# EasyEDA Pro project OMO - WayBox.eprj, schematic Schematic2
Board Name: Board2; Create Date: 2025-07-23; Page Name: P1; Project Name: OMO - WayBox; Schematic Name: Schematic2; Update Date: 2025-07-24; Company: EasyEDA.com; Page Size: A4; Version: V1.0
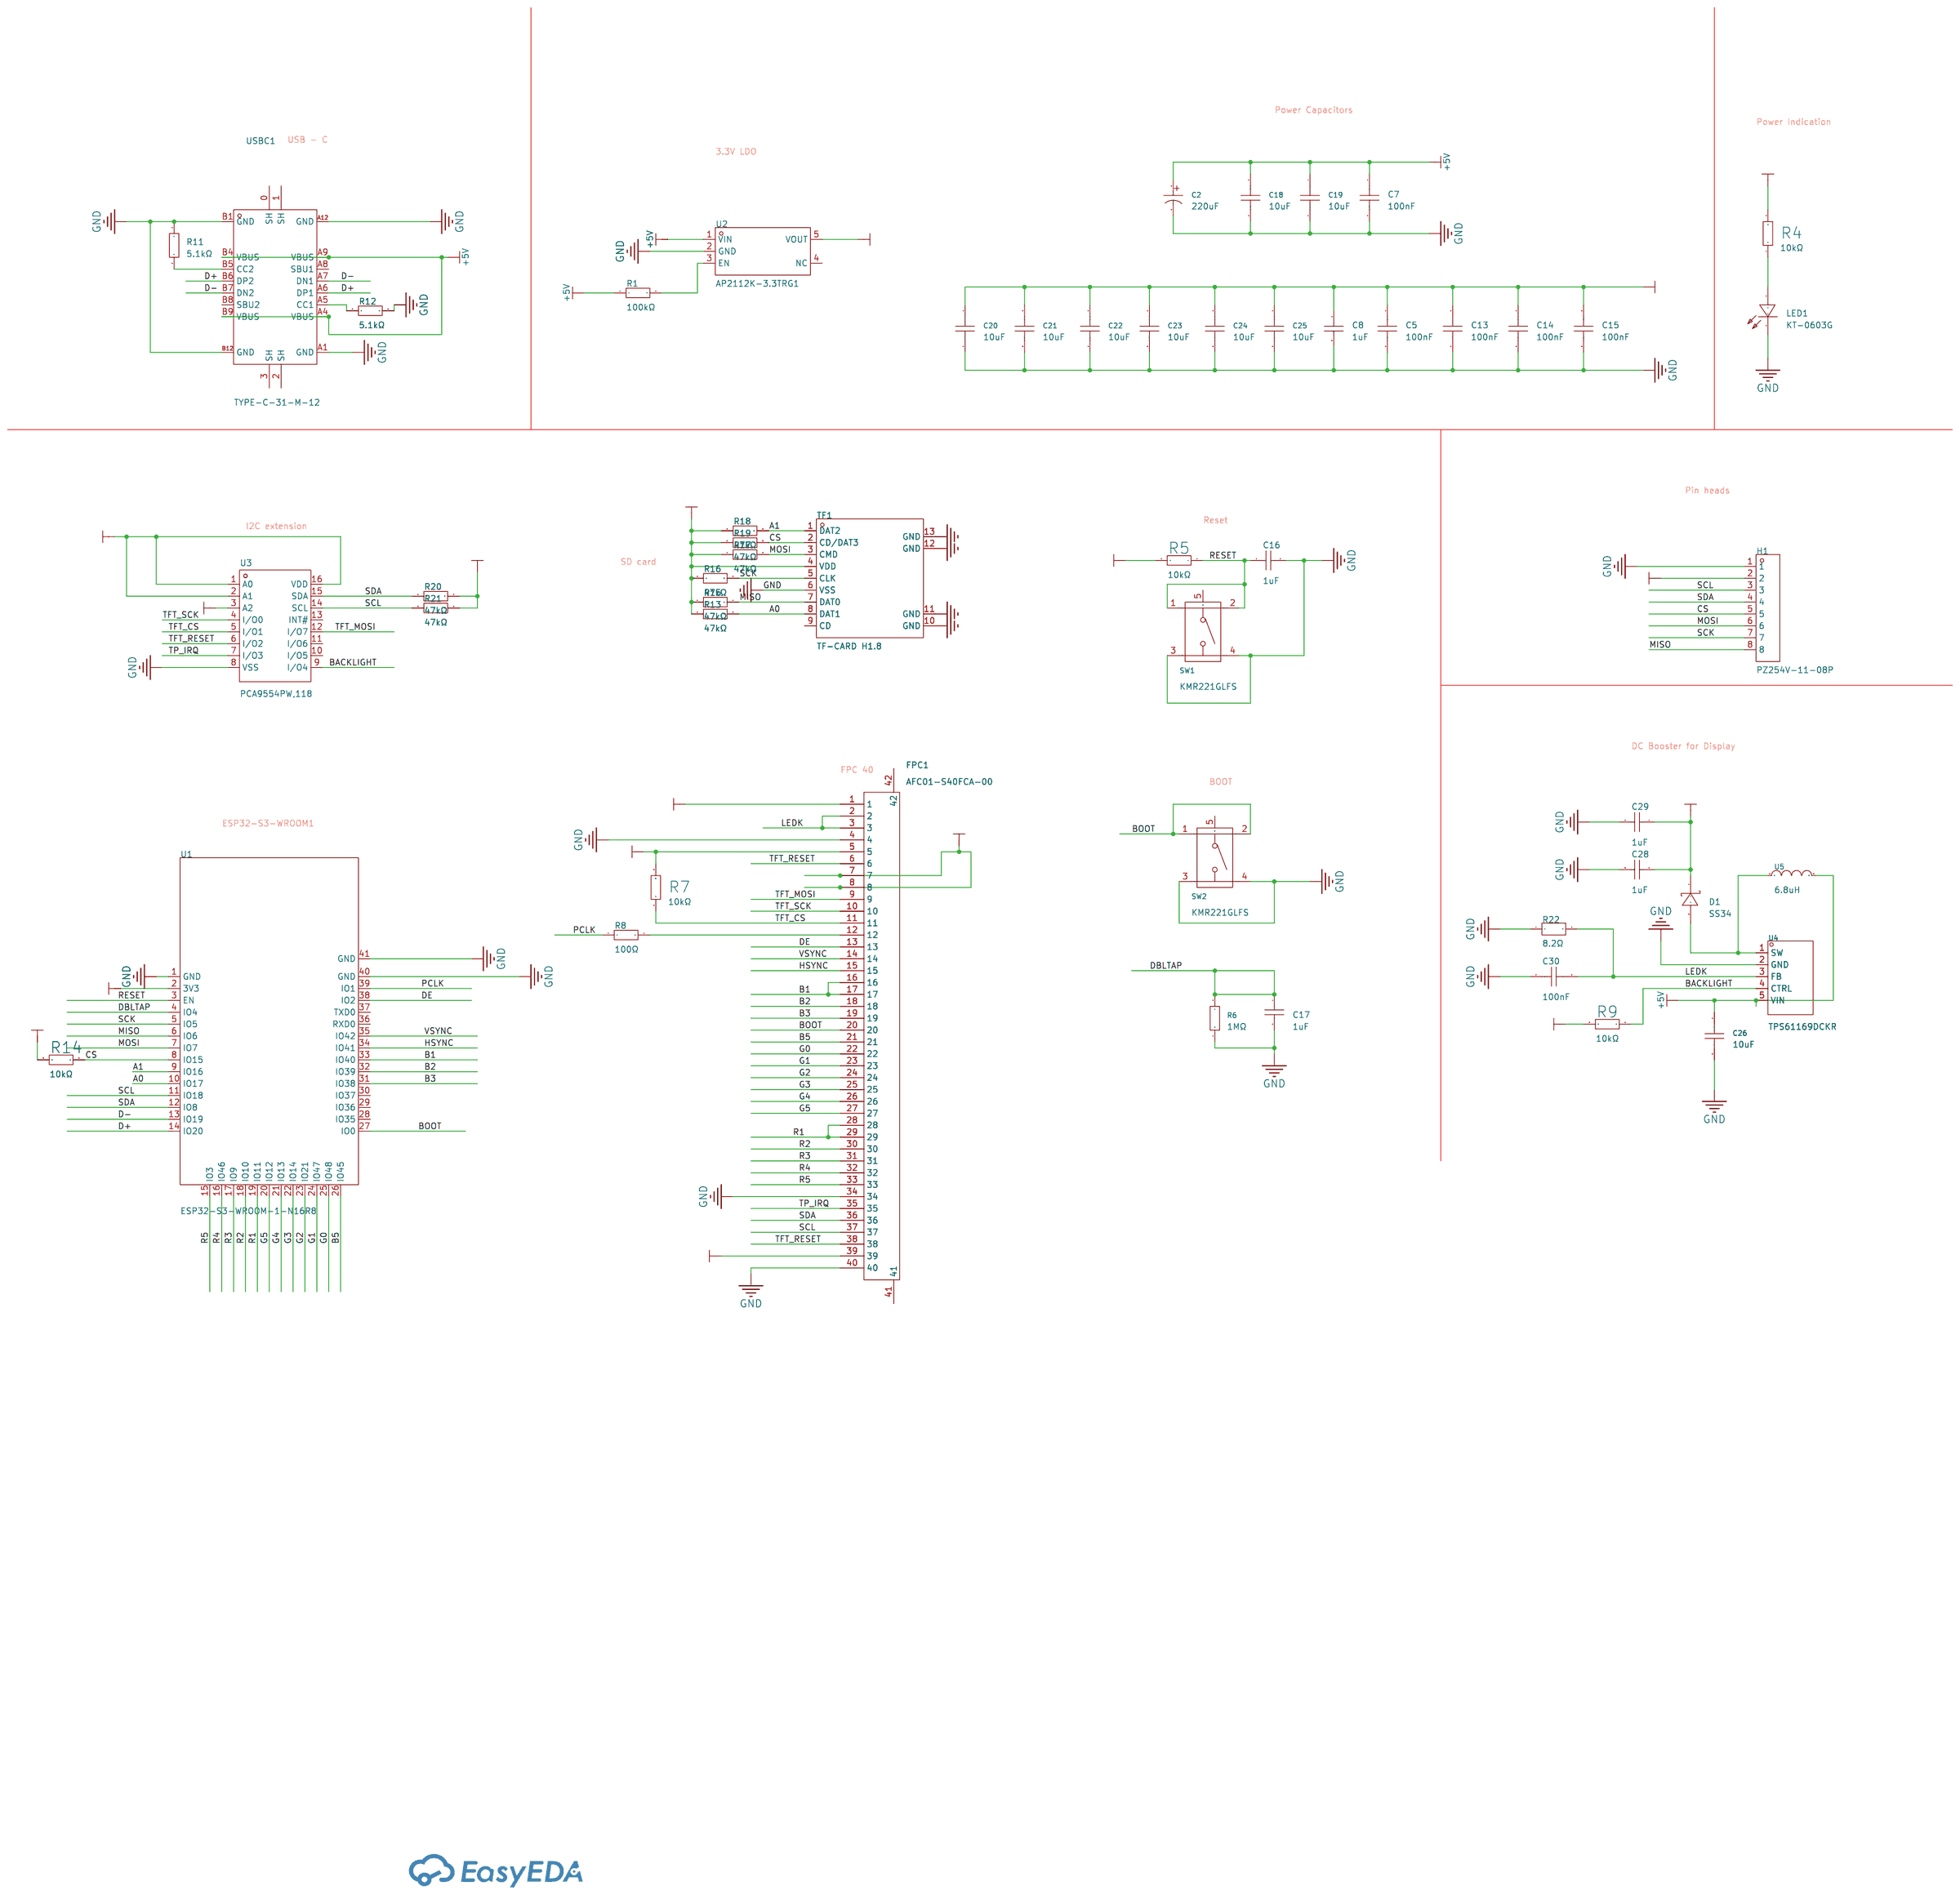
[diagram p1: schematic sheet]

## Parts
C2  220uF  [CAP-SMD_BD6.3-L6.6-W6.6-LS7.2-FD]
C5  100nF  [C0402]
C7  100nF  [C0402]
C8  1uF  [C0603]
C13  100nF  [C0402]
C14  100nF  [C0402]
C15  100nF  [C0402]
C16  1uF  [C0603]
C17  1uF  [C0603]
C18  10uF  [C0603]
C19  10uF  [C0603]
C20  10uF  [C0603]
C21  10uF  [C0603]
C22  10uF  [C0603]
C23  10uF  [C0603]
C24  10uF  [C0603]
C25  10uF  [C0603]
C26  10uF  [C0603]
C28  1uF  [C0603]
C29  1uF  [C0603]
C30  100nF  [C0402]
D1  SS34  [SMA_L4.3-W2.6-LS5.2-RD]
FPC1  AFC01-S40FCA-00  [FPC-SMD_P0.50-40P_FGS-XJ-H2.0]
H1  PZ254V-11-08P  [HDR-TH_8P-P2.54-V-M]
LED1  KT-0603G  [LED0603-RD]
R1  100kΩ  [R0603]
R4  10kΩ  [R0603]
R5  10kΩ  [R0603]
R6  1MΩ  [R0603]
R7  10kΩ  [R0603]
R8  100Ω  [R0402]
R9  10kΩ  [R0603]
R11  5.1kΩ  [R0603]
R12  5.1kΩ  [R0603]
R13  47kΩ  [R0402]
R14  10kΩ  [R0603]
R15  47kΩ  [R0402]
R16  47kΩ  [R0402]
R17  47kΩ  [R0402]
R18  47kΩ  [R0402]
R19  47kΩ  [R0402]
R20  47kΩ  [R0402]
R21  47kΩ  [R0402]
R22  8.2Ω  [R0402]
SW1  KMR221GLFS  [KEY-SMD_KMR2XXGXXX]
SW2  KMR221GLFS  [KEY-SMD_KMR2XXGXXX]
TF1  TF-CARD H1.8  [TF-SMD_TF-CARD-H1.8]
U1  ESP32-S3-WROOM-1-N16R8  [WIRELM-SMD_ESP32-S3-WROOM-1]
U2  AP2112K-3.3TRG1  [SOT-25-5_L2.9-W1.6-P0.95-LS2.8-BL]
U3  PCA9554PW,118  [TSSOP-16_L5.0-W4.4-P0.65-LS6.4-BL]
U4  TPS61169DCKR  [SC-70-5_L2.1-W1.3-P0.65-LS2.1-BR]
U5  6.8uH  [IND-SMD_L4.5-W4.1_TMPC0412HP]
USBC1  TYPE-C-31-M-12  [USB-C_SMD-TYPE-C-31-M-12]

## Library data of the parts
C2 = RVT0J221M0605: LCSC Part Name: 220uF ±20% 6.3V; Supplier Part: C32514; Manufacturer: HONOR(荣誉); Supplier Footprint: SMD,D6.3xL5.4mm; JLCPCB Part Class: Extended Part; Datasheet: https://atta.szlcsc.com/upload/public/pdf/source/20210521/C113284_25C86AE95FB541053FE695F13EA8E7D0.pdf; Supplier: LCSC; Tolerance: ±20%; Lifetime @ Temp: 2000hrs@105℃; Operating Temperature: -55℃~+105℃
C5 C7 C13-C15 C30 = CL05B104KO5NNNC: LCSC Part Name: 100nF ±10% 16V; Supplier Part: C1525; Manufacturer: SAMSUNG(三星); Supplier Footprint: 0402; JLCPCB Part Class: Basic Part; Datasheet: https://atta.szlcsc.com/upload/public/pdf/source/20160218/1457707763339.pdf; Supplier: LCSC; Tolerance: ±10%
C8 C16 C17 C28 C29 = CL10A105KO8NNNC: LCSC Part Name: 1uF ±10% 16V; Supplier Part: C1592; Manufacturer: SAMSUNG(三星); Supplier Footprint: 0603; JLCPCB Part Class: Extended Part; Datasheet: https://atta.szlcsc.com/upload/public/pdf/source/20220919/9FBE606BE0D9532D730F292EB26DC5BB.pdf; Supplier: LCSC; Tolerance: ±10%
C18-C26 = GRM188R61E106KA73D: LCSC Part Name: 10uF ±10% 25V; Supplier Part: C344022; Manufacturer: muRata(村田); Supplier Footprint: 0603; JLCPCB Part Class: Extended Part; Datasheet: https://atta.szlcsc.com/upload/public/pdf/source/20181211/C344022_BB98D43E7DA95E5A749FBFE073C8A3E0.pdf; Supplier: LCSC; Tolerance: ±10%
D1 = SS34_C8678: LCSC Part Name: 电压:40V 电流:3A; Supplier Part: C8678; Manufacturer: MDD(辰达半导体); Supplier Footprint: SMA(DO-214AC); JLCPCB Part Class: Basic Part; Datasheet: https://atta.szlcsc.com/upload/public/pdf/source/20240710/2118BB86FDDB2E0B294389AC1F3F65C8.pdf; Supplier: LCSC; Diode Configuration: Independent Type; Forward Voltage (Vf@If): 550mV@3A; Reverse Voltage (Vr): 40V; Rectified Current: 3A; Reverse Leakage Current (Ir): 500uA@40V
FPC1 = AFC01-S40FCA-00: LCSC Part Name: 间距:0.5mm P数:40P 翻盖式 下接; Supplier Part: C262674; Manufacturer: JS(钜硕电子); Supplier Footprint: SMD,P=0.5mm,卧贴; JLCPCB Part Class: 扩展库; Datasheet: https://atta.szlcsc.com/upload/public/pdf/source/20190816/C413942_2A72D1AC756EAE17EEDF756A339D4500.pdf; Supplier: LCSC; Locking Feature: 翻盖式; Contact Type: 下接; Number of Contacts: 40P; Pitch: 0.5mm; Mounting Type: 卧贴; FFC, FCB Thickness: 0.3mm; Height Above Board: 2mm
H1 = PZ254V-11-08P: LCSC Part Name: 间距:2.54mm 1x8P 直插 方针; Supplier Part: C492407; Manufacturer: XFCN(兴飞); Supplier Footprint: 插件,P=2.54mm; JLCPCB Part Class: 扩展库; Datasheet: https://atta.szlcsc.com/upload/public/pdf/source/20200309/C492407_83A6FB26A2233368EDB9516968EC6149.pdf; Supplier: LCSC; Pin Structure: 1x8P; Pitch: 2.54mm; Circluar Pins/Square Pins: 方针; Mounting Type: 直插; Number of Rows: 单排; Number of Pins: 8P; Length of Mating Pin: 6mm; Insulation Height: 2.5mm; Length of End Connection Pin: 3mm; Contact Material: 黄铜; Operating Temperature Range: -40℃~+105℃; Color: 黑色
LED1 = KT-0603G: LCSC Part Name: 0603 翠绿 高亮; Supplier Part: C12624; Manufacturer: KENTO; Supplier Footprint: 0603; JLCPCB Part Class: Extended Part; Datasheet: https://atta.szlcsc.com/upload/public/pdf/source/20160120/1457707754255.pdf; Supplier: LCSC; Emitted Color: Emerald
R1 = 0603WAF1003T5E: LCSC Part Name: 100kΩ ±1% 100mW 厚膜电阻; Supplier Part: C25803; Manufacturer: UNI-ROYAL(厚声); Supplier Footprint: 0603; Datasheet: https://atta.szlcsc.com/upload/public/pdf/source/20200306/C422600_1E6D84923E4A46A82E41ADD87F860B5C.pdf; Supplier: LCSC; Type: Thick Film Resistors; Tolerance: ±1%; Temperature Coefficient: ±100ppm/℃; Operating Temperature Range: -55℃~+155℃
R4 R5 R7 R9 R14 = 0603WAF1002T5E: LCSC Part Name: 厚膜电阻 10kΩ ±1% 100mW; Supplier Part: C25804; Manufacturer: UNI-ROYAL(厚声); Supplier Footprint: 0603; Datasheet: https://atta.szlcsc.com/upload/public/pdf/source/20200306/C422600_1E6D84923E4A46A82E41ADD87F860B5C.pdf; Supplier: LCSC; Type: Thick Film Resistors; Tolerance: ±1%; Temperature Coefficient: ±100ppm/℃; Operating Temperature Range: -55℃~+155℃
R6 = 0603WAF1004T5E: LCSC Part Name: 1MΩ ±1% 100mW 厚膜电阻; Supplier Part: C22935; Manufacturer: UNI-ROYAL(厚声); Supplier Footprint: 0603; JLCPCB Part Class: Basic Part; Datasheet: https://atta.szlcsc.com/upload/public/pdf/source/20200306/C422600_1E6D84923E4A46A82E41ADD87F860B5C.pdf; Supplier: LCSC; Type: Thick Film Resistors; Tolerance: ±1%; Temperature Coefficient: ±100ppm/℃; Operating Temperature Range: -55℃~+155℃
R8 = AR02BTC1000: LCSC Part Name: 薄膜电阻 100Ω ±0.1% 62.5mW; Supplier Part: C317909; Manufacturer: Viking(光颉); Supplier Footprint: 0402; Datasheet: https://atta.szlcsc.com/upload/public/pdf/source/20191129/C465721_10D49275DB41E427863CE9C8D788770A.pdf; Supplier: LCSC; Type: Thin Film Resistor; Tolerance: ±0.1%; Temperature Coefficient: ±25ppm/℃; Operating Temperature Range: -55℃~+155℃
R11 R12 = 0603WAF5101T5E: LCSC Part Name: 5.1kΩ ±1% 100mW 厚膜电阻; Supplier Part: C23186; Manufacturer: UNI-ROYAL(厚声); Supplier Footprint: 0603; Datasheet: https://atta.szlcsc.com/upload/public/pdf/source/20200306/C422600_1E6D84923E4A46A82E41ADD87F860B5C.pdf; Supplier: LCSC; Type: Thick Film Resistors; Tolerance: ±1%; Temperature Coefficient: ±100ppm/℃; Operating Temperature Range: -55℃~+155℃
R13 R15-R21 = 0402WGF4702TCE: LCSC Part Name: 47kΩ ±1% 62.5mW 厚膜电阻; Supplier Part: C25792; Manufacturer: UNI-ROYAL(厚声); Supplier Footprint: 0402; JLCPCB Part Class: 基础库; Datasheet: https://atta.szlcsc.com/upload/public/pdf/source/20200306/C422600_1E6D84923E4A46A82E41ADD87F860B5C.pdf; Supplier: LCSC; Type: 厚膜电阻; Tolerance: ±1%; Power(Watts): 62.5mW; Overload Voltage (Max): 50V; Temperature Coefficient: ±100ppm/℃; Operating Temperature Range: -55℃~+155℃
R22 = FRC0402F8R20TS: LCSC Part Name: 8.2Ω ±1% 62.5mW 厚膜电阻; Supplier Part: C2998155; Manufacturer: FOJAN(富捷); Supplier Footprint: 0402; JLCPCB Part Class: 扩展库; Datasheet: https://atta.szlcsc.com/upload/public/pdf/source/20211221/925EC7D7225764EE0046F22065062C87.pdf; Supplier: LCSC; Type: 厚膜电阻; Tolerance: ±1%; Power(Watts): 62.5mW; Voltage-Supply(Max): 50V; Temperature Coefficient: ±200ppm/℃; Operating Temperature: -55℃~+155℃
SW1 SW2 = KMR221GLFS: LCSC Part Name: 4.6*2.8*1.9mm 立贴 轻触开关; Supplier Part: C72443; Manufacturer: C&K; Supplier Footprint: SMD; JLCPCB Part Class: Extended Part; Datasheet: https://atta.szlcsc.com/upload/public/pdf/source/20181012/C265019_000848423B8E84768868498C37CC451B.pdf; Supplier: LCSC; Circuit: SPST; Actuator Style: Round Button; Operating Force: 200gf; Mounting Style: Brick nogging; Switch Length: 4.6mm; Switch Width: 2.8mm; Switch Height: 1.9mm; Contact Current: 50mA; Voltage Rating (DC): 32V; Pin Style: Gull Wing; Operating Temperature: -40℃~+85℃
TF1 = TF-CARD H1.8: LCSC Part Name: 自弹式 MicroSD卡(TF卡) 卡座; Supplier Part: C7529389; Manufacturer: SHOU HAN(首韩); Supplier Footprint: SMD; JLCPCB Part Class: 扩展库; Datasheet: https://atta.szlcsc.com/upload/public/pdf/source/20230818/611DB5E7B45C91025B0B37F957961A64.pdf; Supplier: LCSC; Card Connection Mode: 自弹式; Card Type: MicroSD卡(TF卡); Connector Type: 卡座; Maximum Body Height: 1.8mm; Operating Temperature Range: -40℃~+70℃
U1 = ESP32-S3-WROOM-1-N16R8: LCSC Part Name: 通用型Wi-Fi+低功耗蓝牙MCU模组; Supplier Part: C2913202; Manufacturer: ESPRESSIF(乐鑫); Supplier Footprint: SMD,18x25.5mm; JLCPCB Part Class: Extended Part; Datasheet: https://atta.szlcsc.com/upload/public/pdf/source/20241030/6A412B13087E1327DF6279F5735253CA.pdf; Supplier: LCSC
U2 = AP2112K-3.3TRG1: LCSC Part Name: 输入6V 输出3.3V 600mA; Supplier Part: C51118; Manufacturer: DIODES(美台); Supplier Footprint: SOT-25-5; JLCPCB Part Class: Extended Part; Datasheet: https://atta.szlcsc.com/upload/public/pdf/source/20171221/C51118_15138312998391195590.pdf; Supplier: LCSC; Output Type: Fixed; Maximum Input Voltage: 6V; Output Voltage: 3.3V; Output Current: 600mA; Power Supply Rejection Ratio (PSRR): 65dB@(1kHz); Dropout Voltage: 400mV@(600mA); standby current: 80uA; Feature: ESD Protection；Automatic Discharge Function；Low ESR；Thermal Protection(TSD)；Overcurrent Protection(OCP)；With ability; Operating Temperature: -40℃~+85℃; Output Polarity: Positive electrode; Number of Outputs: 1
U3 = PCA9554PW,118: LCSC Part Name: 带复位的8位I2C总线和SMBus I/O端口; Supplier Part: C17230; Manufacturer: NXP(恩智浦); Supplier Footprint: TSSOP-16; JLCPCB Part Class: Extended Part; Datasheet: https://atta.szlcsc.com/upload/public/pdf/source/20130823/1457706640146.pdf; Supplier: LCSC; Interface: I2C；SMBus; Number of I/O: 8; Interrupt Output: 有中断输出; Supply Voltage: 2.3V~5.5V; Output Source current: 10mA; Output Sink Current: 25mA; Clock Frequency: 400kHz; Operating Temperature: -40℃~+85℃
U4 = TPS61169DCKR: Supplier Part: C71045; Manufacturer: TI(德州仪器); Supplier Footprint: SC-70-5; JLCPCB Part Class: Extended Part; Datasheet: https://www.ti.com/cn/lit/gpn/tps61169; Supplier: LCSC; Type: DC-DCVoltage Stabilizer; Input Voltage: 2.7V~5.5V; Switch Frequency: 1.2MHz; Channels: 1; Output Current: 1.8A; Dimming: PWM; Topology: boost converter; Operating temperature: -40℃~+125℃
U5 = MDA4020-6R8M: LCSC Part Name: 6.8uH ±20% 2.4A; Supplier Part: C2847472; Manufacturer: KOHERelec(科或); Supplier Footprint: SMD,4.1x4.5mm; JLCPCB Part Class: Extended Part; Datasheet: https://atta.szlcsc.com/upload/public/pdf/source/20210804/C2847473_8F6BBD426BC36F081916EED582539326.pdf; Supplier: LCSC; Tolerance: ±20%; DC Resistance (DCR): 131mΩ
USBC1 = TYPE-C-31-M-12: LCSC Part Name: Type-C 母; Supplier Part: C165948; Manufacturer: 韩国韩荣; Supplier Footprint: SMD; Datasheet: https://atta.szlcsc.com/upload/public/pdf/source/20220525/466408E853115E789EDB0DDC29077C05.pdf; Supplier: LCSC; Connector Type: Type-C; Gender: Female; Number of Contacts: 16P; Number of Ports: 1; Current Rating - Power (Max): 5A

## Nets
3V3: C5.1 C8.1 C13.1 C14.1 C15.1 C20.1 C21.1 C22.1 C23.1 C24.1 C25.1 FPC1.5 FPC1.7 FPC1.8 FPC1.39 H1.2 R4.2 R5.2 R7.2 R9.2 R13.1 R14.2 R15.1 R16.1 R17.1 R18.1 R19.1 R20.2 R21.2 TF1.4(VDD) U1.2(3V3) U2.5(VOUT) U3.1(A0) U3.2(A1) U3.3(A2) U3.16(VDD)
+5V: C2.1 C7.1 C18.1 C19.1 C26.1 R1.1 U2.1(VIN) U4.5(VIN) U5.2 USBC1.A4(VBUS) USBC1.A9(VBUS) USBC1.B4(VBUS) USBC1.B9(VBUS)
+24V: C28.1 C29.1 D1.1(K) FPC1.1
GND: C2.2 C5.2 C7.2 C8.2 C13.2 C14.2 C15.2 C16.2 C17.2 C18.2 C19.2 C20.2 C21.2 C22.2 C23.2 C24.2 C25.2 C26.2 C28.2 C29.2 C30.1 FPC1.4 FPC1.34 FPC1.40 H1.1 LED1.1(K) R6.1 R11.1 R12.2 R22.1 SW1.3 SW1.4 SW2.3 SW2.4 TF1.6(VSS) TF1.10(GND) TF1.11(GND) TF1.12(GND) TF1.13(GND) U1.1(GND) U1.40(GND) U1.41(GND) U2.2(GND) U3.8(VSS) U4.2(GND) USBC1.A1(GND) USBC1.A12(GND) USBC1.B1(GND) USBC1.B12(GND)
A0: R13.2 TF1.8(DAT1) U1.10(IO17)
A1: R18.2 TF1.1(DAT2) U1.9(IO16)
B1: FPC1.16 FPC1.17 U1.33(IO40)
B2: FPC1.18 U1.32(IO39)
B3: FPC1.19 U1.31(IO38)
B5: FPC1.21 U1.26(IO45)
BACKLIGHT: R9.1 U3.9(I/O4) U4.4(CTRL)
BOOT: FPC1.20 SW2.1 SW2.2 U1.27(IO0)
CS: H1.5 R14.1 R19.2 TF1.2(CD/DAT3) U1.8(IO15)
D+: U1.14(IO20) USBC1.A6(DP1) USBC1.B6(DP2)
D-: U1.13(IO19) USBC1.A7(DN1) USBC1.B7(DN2)
DBLTAP: C17.1 R6.2 U1.4(IO4)
DE: FPC1.13 U1.38(IO2)
G0: FPC1.22 U1.25(IO48)
G1: FPC1.23 U1.24(IO47)
G2: FPC1.24 U1.23(IO21)
G3: FPC1.25 U1.22(IO14)
G4: FPC1.26 U1.21(IO13)
G5: FPC1.27 U1.20(IO12)
HSYNC: FPC1.15 U1.34(IO41)
LEDK: C30.2 FPC1.2 FPC1.3 R22.2 U4.3(FB)
MISO: H1.8 R15.2 TF1.7(DAT0) U1.6(IO6)
MOSI: H1.6 R17.2 TF1.3(CMD) U1.7(IO7)
PCLK: R8.1 U1.39(IO1)
R1: FPC1.28 FPC1.29 U1.19(IO11)
R2: FPC1.30 U1.18(IO10)
R3: FPC1.31 U1.17(IO9)
R4: FPC1.32 U1.16(IO46)
R5: FPC1.33 U1.15(IO3)
RESET: C16.1 R5.1 SW1.1 SW1.2 U1.3(EN)
SCK: H1.7 R16.2 TF1.5(CLK) U1.5(IO5)
SCL: FPC1.37 H1.3 R21.1 U1.11(IO18) U3.14(SCL)
SDA: FPC1.36 H1.4 R20.1 U1.12(IO8) U3.15(SDA)
TFT_CS: FPC1.11 R7.1 U3.5(I/O1)
TFT_MOSI: FPC1.9 U3.12(I/O7)
TFT_RESET: FPC1.6 FPC1.38 U3.6(I/O2)
TFT_SCK: FPC1.10 U3.4(I/O0)
TP_IRQ: FPC1.35 U3.7(I/O3)
VSYNC: FPC1.14 U1.35(IO42)
$1N9703: R1.2 U2.3(EN)
$1N9711: LED1.2(A) R4.1
$1N9744: FPC1.12 R8.2
$1N9806: D1.2(A) U4.1(SW) U5.1
$1N9898: R11.2 USBC1.B5(CC2)
$1N9904: R12.1 USBC1.A5(CC1)

Not connected (* = marked no-connect by the designer): FPC1 41 42; SW1 5; SW2 5; TF1 9(CD); U1 28(IO35) 29(IO36) 30(IO37) 36(RXD0) 37(TXD0); U2 4(NC); U3 10(I/O5) 11(I/O6) 13(INT#); USBC1 0(SH) 1(SH) 2(SH) 3(SH) A8(SBU1) B8(SBU2)

## Notes on the sheet
- Power Capacitors
- Power Indication
- USB - C
- 3.3V LDO
- Pin heads
- I2C extension
- Reset
- SD card
- DC Booster for Display
- FPC 40
- BOOT
- ESP32-S3-WROOM1
